# EAGLE schematic Control Board V2 (EAGLE 7.4.0)
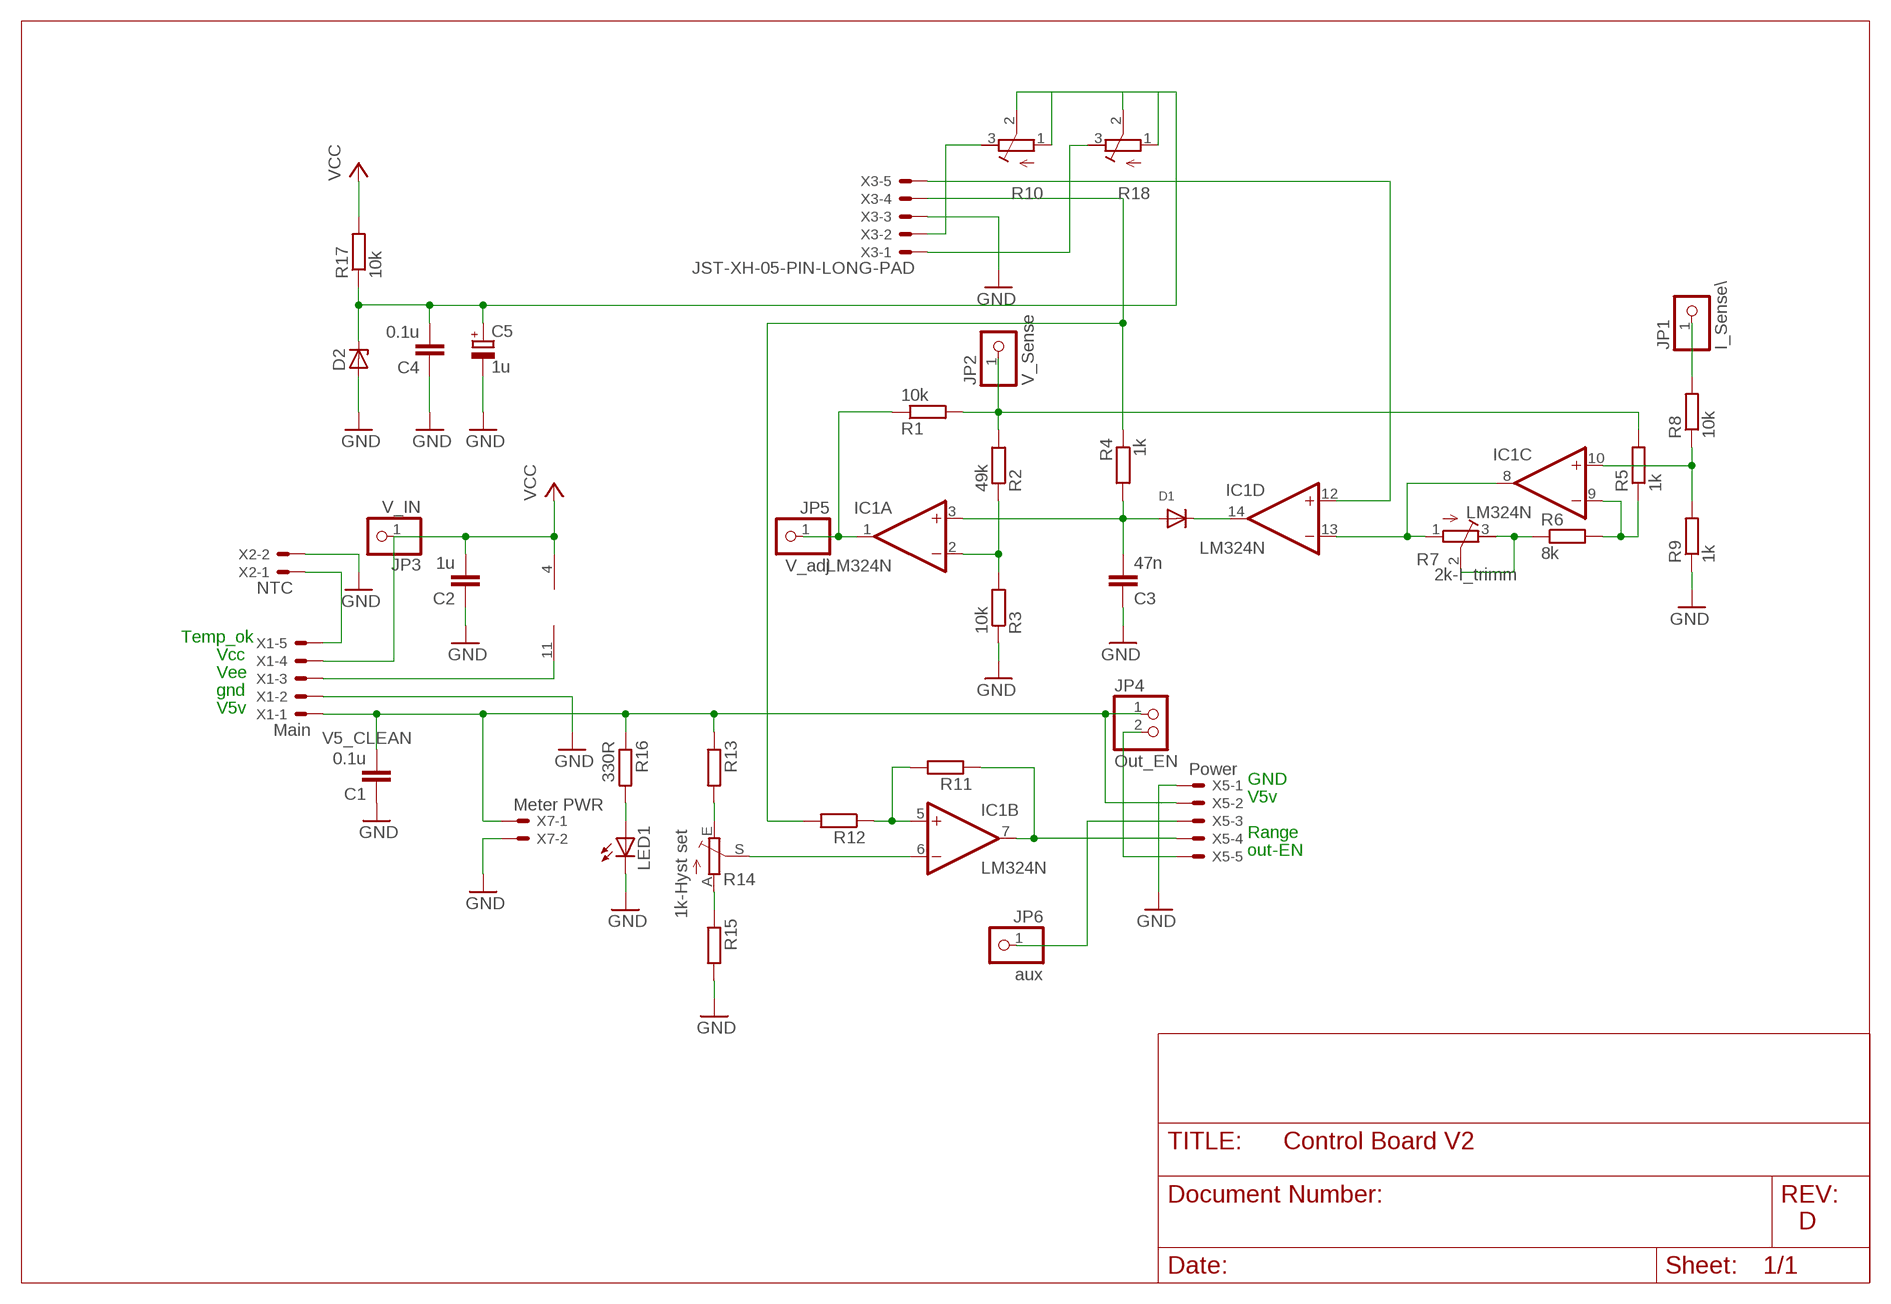
[diagram p0: schematic, sheet 1]

## Parts
C1  0.1u  C-EU050-025X075  [C050-025X075]
C2  1u  C-EU050-025X075  [C050-025X075]
C3  47n  C-EU050-025X075  [C050-025X075]
C4  0.1u  C-EU050-025X075  [C050-025X075]
C5  1u  CPOL-EUE5-10.5  [E5-10,5]
D1  DIODEDO-1N4148  [DO-1N4148]
D2  ZENER-DIODEDO35Z10  [DO35Z10]
IC1  LM324N  [DIL14]
JP1  I_Sense\  PINHD-1X1  [1X01]
JP2  V_Sense  PINHD-1X1  [1X01]
JP3  V_IN  PINHD-1X1  [1X01]
JP4  Out_EN  PINHD-1X2  [1X02]
JP5  V_adj  PINHD-1X1  [1X01]
JP6  aux  PINHD-1X1  [1X01]
LED1  LED3MM  [LED3MM]
R1  10k  R-EU_0204/7  [0204/7]
R2  49k  R-EU_0204/7  [0204/7]
R3  10k  R-EU_0204/7  [0204/7]
R4  1k  R-EU_0204/7  [0204/7]
R5  1k  R-EU_0204/5  [0204/5]
R6  8k  R-EU_0204/2V  [0204V]
R7  2k-I_trimm  R-TRIMM64W  [RTRIM64W]
R8  10k  R-EU_0204/7  [0204/7]
R9  1k  R-EU_0204/7  [0204/7]
R10  R-TRIMM64W  [RTRIM64W]
R11  R-EU_0204/5  [0204/5]
R12  R-EU_0204/2V  [0204V]
R13  R-EU_0204/2V  [0204V]
R14  1k-Hyst set  TRIM_EU-B25P  [B25P]
R15  R-EU_0204/7  [0204/7]
R16  330R  R-EU_0207/2V  [0207/2V]
R17  10k  R-EU_0204/7  [0204/7]
R18  R-TRIMM64W  [RTRIM64W]
X1  Main  JST-XH-05-PIN-LONG-PAD  [JST-XH-05-PACKAGE-LONG-PAD]
X2  NTC  JST-XH-02-PIN-LONG-PAD  [JST-XH-02-PACKAGE-LONG-PAD]
X3  JST-XH-05-PIN-LONG-PAD  [JST-XH-05-PACKAGE-LONG-PAD]
X5  Power  JST-XH-05-PIN-LONG-PAD  [JST-XH-05-PACKAGE-LONG-PAD]
X7  Meter PWR  JST-XH-02-PIN-LONG-PAD  [JST-XH-02-PACKAGE-LONG-PAD]

## Nets
GND: C1.1 C2.1 C3.1 C4.1 C5.- D2.A LED1.K(C) R3.1 R9.1 R15.2 X1.2 X2.2 X3.3 X5.1 X7.2
N$1: D1.C IC1.14(D:OUT)
N$2: X1.5 X2.1
N$4: IC1.1(A:OUT) JP5.1 R1.1
N$5: JP6.1 X5.3
N$6: IC1.2(A:-IN) R2.1 R3.2
N$7: C3.2 D1.A IC1.3(A:+IN) R4.2
N$8: JP4.2 X5.5
N$9: R6.1 R7.2(S) R7.3(E)
N$10: IC1.9(C:-IN) R5.1 R6.2
N$11: IC1.8(C:OUT) IC1.13(D:-IN) R7.1(A)
N$12: JP1.1 R8.2
N$15: LED1.A R16.2
N$16: IC1.11(P:V-) X1.3
N$17: IC1.12(D:+IN) X3.5
N$18: IC1.6(B:-IN) R14.S
N$19: R10.3(E) X3.2
N$20: R18.3(E) X3.1
N$21: JP2.1 R1.2 R2.2 R5.2
N$23: IC1.7(B:OUT) R11.1 X5.4
N$24: IC1.5(B:+IN) R11.2 R12.1
N$25: R13.2 R14.E
N$27: C4.2 C5.+ D2.C R10.1(A) R10.2(S) R17.1 R18.1(A) R18.2(S)
N$28: R14.A R15.1
N$32: R4.1 R12.2 X3.4
N$34: IC1.10(C:+IN) R8.1 R9.2
V5_CLEAN: C1.2 JP4.1 R13.1 R16.1 X1.1 X5.2 X7.1
VCC: C2.2 IC1.4(P:V+) JP3.1 R17.2 X1.4

## Notes on the sheet
- Temp_ok
- Vcc
- Vee
- gnd
- V5v
- GND
- V5v
- Range
- out-EN
- D

## Library data of the parts
C1-C4 = rcl:C-EU: CAPACITOR, European symbol
C5 = rcl:CPOL-EU: POLARIZED CAPACITOR, European symbol
D1 = adafruit:DIODE: Diode SMADIODE - SMA Surface Mount Package 20V 1A Schottky Diode Digikey: 641-1014-6-ND DO-1N4148 - Through Hole Small Current Diode SOD-123 20V 1 A (.5mV Vf) Schottky Diode - Digikey: MBRX120TPMSCT-ND SOD-323 10V 570mA (.38mV Vf, 3ns) Schottky Diode - Digikey: ZLLS410CT-ND SOD-523 30V 30mA Schottky Diode (RB751S-40TE61) - Digikey: RB751S-40TE61CT-ND SOT23-R/W - SOT23 Package (R = Solder Paste/Reflow Ovens, W = Hand-Soldering) BAT54Film 40V 300mA - Digikey: 497-7162-1-ND
D2 = diode:ZENER-DIODE: Z-Diode
IC1 = linear:LM324: OP AMP
JP1-JP3 JP5 JP6 = adafruit:PINHD-1X1: Pin header 1x1 for 0.1" spacing With round pins
JP4 = pinhead:PINHD-1X2: PIN HEADER
LED1 = adafruit:LED: LED OSRAM: - CHIPLED LG R971, LG N971, LY N971, LG Q971, LY Q971, LO R971, LY R971 LH N974, LH R974 LS Q976, LO Q976, LY Q976 LO Q996 - Hyper CHIPLED LW Q18S LB Q993, LB Q99A, LB R99A - SideLED LS A670, LO A670, LY A670, LG A670, LP A670 LB A673, LV A673, LT A673, LW A673 LH A674 LY A675 LS A676, LA A676, LO A676, LY A676, LW A676 LS A679, LY A679, LG A679 - Hyper Micro SIDELED® LS Y876, LA Y876, LO Y876, LY Y876 LT Y87S - SmartLED LW L88C, LW L88S LB L89C, LB L89S, LG L890 LS L89K, LO L89K, LY L89K LS L896, LA L896, LO L896, LY L896 - TOPLED LS T670, LO T670, LY T670, LG T670, LP T670 LSG T670, LSP T670, LSY T670, LOP T670, LYG T670 LG T671, LOG T671, LSG T671 LB T673, LV T673, LT T673, LW T673 LH T674 LS T676, LA T676, LO T676, LY T676, LB T676, LH T676, LSB T676, LW T676 LB T67C, LV T67C, LT T67C, LS T67K, LO T67K, LY T67K, LW E67C LS E67B, LA E67B, LO E67B, LY E67B, LB E67C, LV E67C, LT E67C LW T67C LS T679, LY T679, LG T679 LS T770, LO T770, LY T770, LG T770, LP T770 LB T773, LV T773, LT T773, LW T773 LH T774 LS E675, LA E675, LY E675, LS T675 LS T776, LA T776, LO T776, LY T776, LB T776 LHGB T686 LT T68C, LB T68C - Hyper Mini TOPLED® LB M676 - Mini TOPLED Santana® LG M470 LS M47K, LO M47K, LY M47K Source: http://www.osram.convergy.de/
R1-R6 R8 R9 R11-R13 R15 R17 = rcl:R-EU_: RESISTOR, European symbol
R7 R10 R18 = rcl:R-TRIMM: Trimm resistor
R14 = pot:TRIM_EU-: POTENTIOMETER
R16 = resistor:R-EU_: RESISTOR, European symbol
X1 X3 X5 = Rembrandt Electronics - JST XH Connectors v1-0:JST-XH-05-PIN: JST XH Connector 2 Pin Wire to board connector. Pitch: 2,54 mm, (0.100") Number of pins: 5 Created by Rembrandt Electronics www.rembrandtelectronics.com
X2 X7 = Rembrandt Electronics - JST XH Connectors v1-0:JST-XH-02-PIN: JST XH Connector 2 Pin Wire to board connector. Pitch: 2,54 mm, (0.100") Number of pins: 2 Created by Rembrandt Electronics www.rembrandtelectronics.com